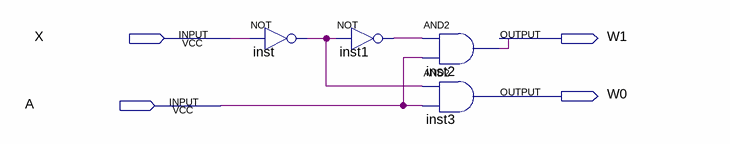
[diagram p0: schematic sheet]
// Quartus schematic 1to2_decoder.bdf as structural Verilog: 4 symbols, 4 pins
module \1to2_decoder  (
  input  X,
  input  A,
  output W1,
  output W0
);

  wire inst1_out, inst_out;

  not inst (inst_out, X);
  not inst1 (inst1_out, inst_out);
  and inst2 (W1, inst1_out, A);
  and inst3 (W0, inst_out, A);
endmodule
